# Altium schematic sheet Sheet1.SchDoc
size A2
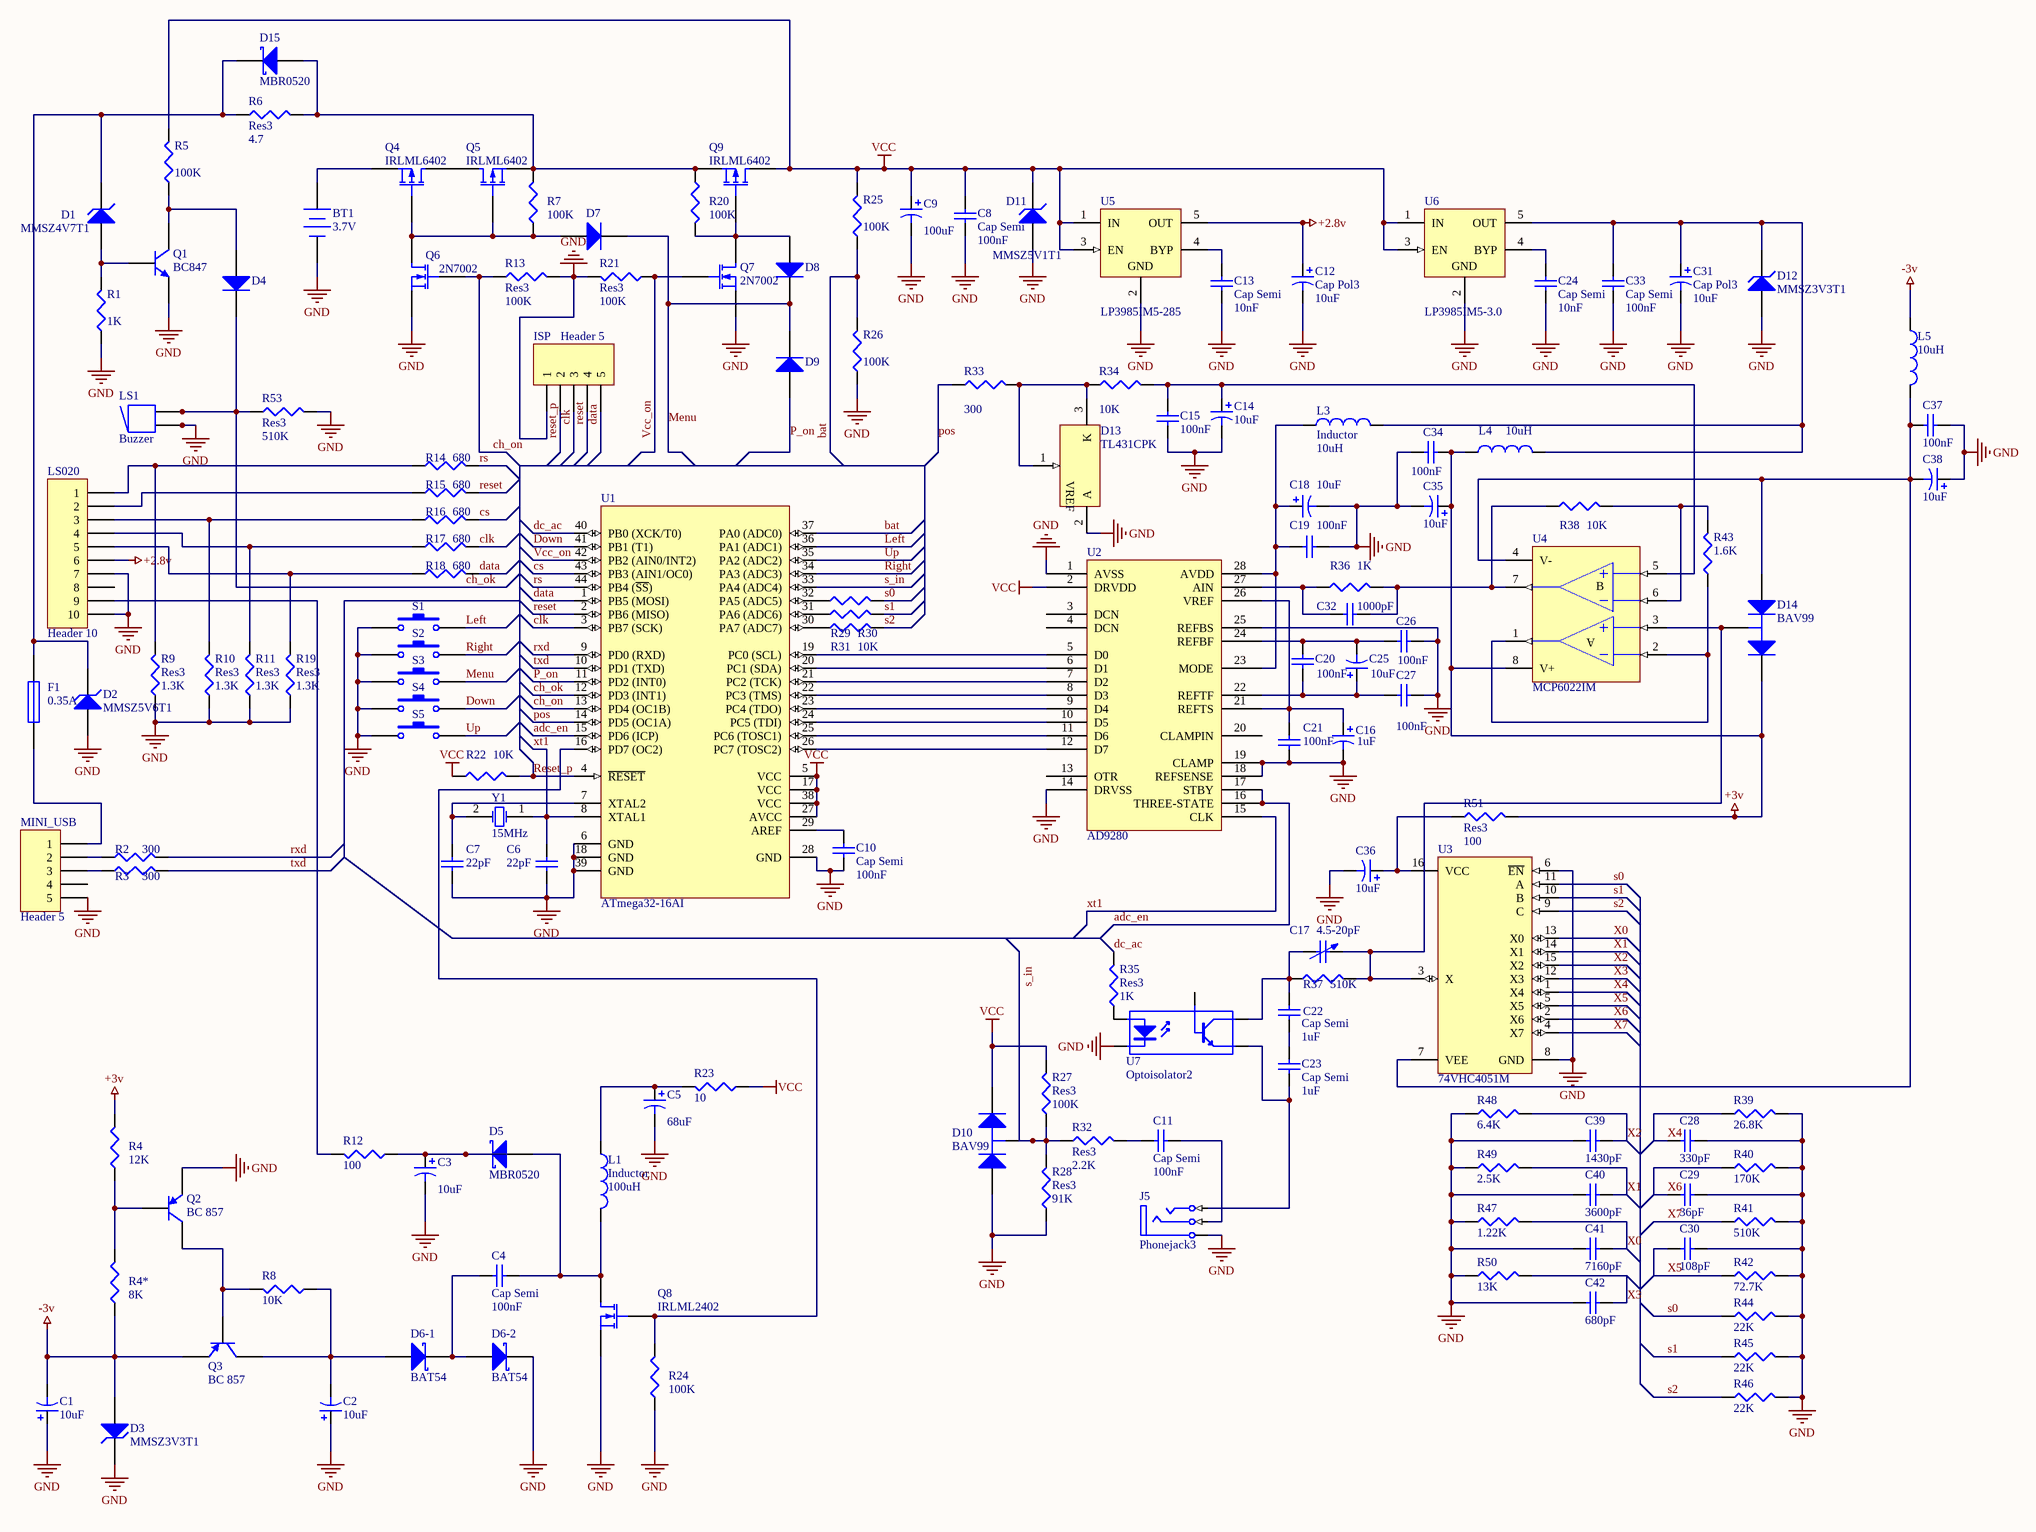
[diagram p0: Sheet1.SchDoc]

## Parts
BT1  3.7V  [BAT-2]
C1  value 10uF  [2220]  (hidden comment: Cap Pol3)
C2  value 10uF  [2220]  (hidden comment: Cap Pol3)
C3  value 10uF  [2220]  (hidden comment: Cap Pol3)
C4  Cap Semi  value 100nF  [C1206]
C5  value 68uF  [2220]  (hidden comment: Cap Pol3)
C6  value 22pF  [C1206]  (hidden comment: Cap Semi)
C7  value 22pF  [C1206]  (hidden comment: Cap Semi)
C8  Cap Semi  value 100nF  [C1206]
C9  value 100uF  [2220]  (hidden comment: Cap Pol3)
C10  Cap Semi  value 100nF  [C1206]
C11  Cap Semi  value 100nF  [C1206]
C12  Cap Pol3  value 10uF  [2220]
C13  Cap Semi  value 10nF  [C1206]
C14  value 10uF  [2220]  (hidden comment: Cap Pol3)
C15  value 100nF  [C1206]  (hidden comment: Cap Semi)
C16  value 1uF  [2220]  (hidden comment: Cap Pol3)
C17  4.5-20pF  [C1210]
C18  value 10uF  [2220]  (hidden comment: Cap Pol3)
C19  value 100nF  [C1206]  (hidden comment: Cap Semi)
C20  value 100nF  [C1206]  (hidden comment: Cap Semi)
C21  value 100nF  [C1206]  (hidden comment: Cap Semi)
C22  Cap Semi  value 1uF  [C1206]
C23  Cap Semi  value 1uF  [C1206]
C24  Cap Semi  value 10nF  [C1206]
C25  value 10uF  [2220]  (hidden comment: Cap Pol3)
C26  value 100nF  [C1206]  (hidden comment: Cap Semi)
C27  value 100nF  [C1206]  (hidden comment: Cap Semi)
C28  value 330pF  [C1206]  (hidden comment: Cap Semi)
C29  value 36pF  [C1206]  (hidden comment: Cap Semi)
C30  value 108pF  [C1206]  (hidden comment: Cap Semi)
C31  Cap Pol3  value 10uF  [2220]
C32  value 1000pF  [C1206]  (hidden comment: Cap Semi)
C33  Cap Semi  value 100nF  [C1206]
C34  value 100nF  [C1206]  (hidden comment: Cap Semi)
C35  value 10uF  [2220]  (hidden comment: Cap Pol3)
C36  value 10uF  [2220]  (hidden comment: Cap Pol3)
C37  value 100nF  [C1206]  (hidden comment: Cap Semi)
C38  value 10uF  [2220]  (hidden comment: Cap Pol3)
C39  value 1430pF  [C1206]  (hidden comment: Cap Semi)
C40  value 3600pF  [C1206]  (hidden comment: Cap Semi)
C41  value 7160pF  [C1206]  (hidden comment: Cap Semi)
C42  value 680pF  [C1206]  (hidden comment: Cap Semi)
D1  MMSZ4V7T1  [425]
D2  MMSZ5V6T1  [425]
D3  MMSZ3V3T1  [425]
D4  Diode  [SMC]  (value not drawn)
D5  MBR0520  [SMB]
D6-1  BAT54  [SOT23_L]
D6-2  BAT54  [SOT23_L]
D7  Diode  [SMC]  (value not drawn)
D8  Diode  [SMC]  (value not drawn)
D9  Diode  [SMC]  (value not drawn)
D10  BAV99  [SOT-23]
D11  MMSZ5V1T1  [425]
D12  MMSZ3V3T1  [425]
D13  TL431CPK  [PK03]
D14  BAV99  [SOT-23]
D15  MBR0520  [SMB]
F1  Current: 0.35A  [PIN-W2/E2.8]  (hidden comment: Fuse 1)
ISP  Header 5  [HDR1X5]
J5  Phonejack3  [JACK/6-V3]
L1  Inductor  V1: 100uH  [3261]
L3  Inductor  value 10uH  [3261]
L4  value 10uH  [3261]  (hidden comment: Inductor)
L5  value 10uH  [3261]  (hidden comment: Inductor)
LS1  Buzzer  [ABSM-1574]
LS020  Header 10  [HDR1X10]
MINI_USB  Header 5  [HDR1X5]
Q1  BC847  [SOT23_L]
Q2  BC 857  [SOT-23B]
Q3  BC 857  [SOT-23B]
Q4  IRLML6402  [SOT23]
Q5  IRLML6402  [SOT23]
Q6  2N7002  [SOT23]
Q7  2N7002  [SOT23]
Q8  IRLML2402  [SOT23]
Q9  IRLML6402  [SOT23]
R1  value 1K  [3225[1210]]  (hidden comment: Res3)
R2  value 300  [3225[1210]]  (hidden comment: Res3)
R3  value 300  [3225[1210]]  (hidden comment: Res3)
R4  value 12K  [3225[1210]]  (hidden comment: Res3)
R4*  value 8K  [3225[1210]]  (hidden comment: Res3)
R5  value 100K  [3225[1210]]  (hidden comment: Res3)
R6  Res3  value 4.7  [6332[2512]]
R7  value 100K  [3225[1210]]  (hidden comment: Res3)
R8  value 10K  [3225[1210]]  (hidden comment: Res3)
R9  Res3  value 1.3K  [3225[1210]]
R10  Res3  value 1.3K  [3225[1210]]
R11  Res3  value 1.3K  [3225[1210]]
R12  value 100  [3225[1210]]  (hidden comment: Res3)
R13  Res3  value 100K  [3225[1210]]
R14  value 680  [3225[1210]]  (hidden comment: Res3)
R15  value 680  [3225[1210]]  (hidden comment: Res3)
R16  value 680  [3225[1210]]  (hidden comment: Res3)
R17  value 680  [3225[1210]]  (hidden comment: Res3)
R18  value 680  [3225[1210]]  (hidden comment: Res3)
R19  Res3  value 1.3K  [3225[1210]]
R20  value 100K  [3225[1210]]  (hidden comment: Res3)
R21  Res3  value 100K  [3225[1210]]
R22  value 10K  [3225[1210]]  (hidden comment: Res3)
R23  value 10  [3225[1210]]  (hidden comment: Res3)
R24  value 100K  [3225[1210]]  (hidden comment: Res3)
R25  value 100K  [3225[1210]]  (hidden comment: Res3)
R26  value 100K  [3225[1210]]  (hidden comment: Res3)
R27  Res3  value 100K  [3225[1210]]
R28  Res3  value 91K  [3225[1210]]
R29  Res3  [3225[1210]]  (value not drawn)
R30  Res3  [3225[1210]]  (value not drawn)
R31  value 10K  [3225[1210]]  (hidden comment: Res3)
R32  Res3  value 2.2K  [3225[1210]]
R33  value 300  [3225[1210]]  (hidden comment: Res3)
R34  value 10K  [3225[1210]]  (hidden comment: Res3)
R35  Res3  value 1K  [3225[1210]]
R36  value 1K  [3225[1210]]  (hidden comment: Res3)
R37  value 510K  [3225[1210]]  (hidden comment: Res3)
R38  value 10K  [3225[1210]]  (hidden comment: Res3)
R39  value 26.8K  [3225[1210]]  (hidden comment: Res3)
R40  value 170K  [3225[1210]]  (hidden comment: Res3)
R41  value 510K  [3225[1210]]  (hidden comment: Res3)
R42  value 72.7K  [3225[1210]]  (hidden comment: Res3)
R43  value 1.6K  [3225[1210]]  (hidden comment: Res3)
R44  value 22K  [3225[1210]]  (hidden comment: Res3)
R45  value 22K  [3225[1210]]  (hidden comment: Res3)
R46  value 22K  [3225[1210]]  (hidden comment: Res3)
R47  value 1.22K  [3225[1210]]  (hidden comment: Res3)
R48  value 6.4K  [3225[1210]]  (hidden comment: Res3)
R49  value 2.5K  [3225[1210]]  (hidden comment: Res3)
R50  value 13K  [3225[1210]]  (hidden comment: Res3)
R51  Res3  value 100  [3225[1210]]
R53  Res3  value 510K  [3225[1210]]
S1  SW-PB  [SPST-2]  (value not drawn)
S2  SW-PB  [SPST-2]  (value not drawn)
S3  SW-PB  [SPST-2]  (value not drawn)
S4  SW-PB  [SPST-2]  (value not drawn)
S5  SW-PB  [SPST-2]  (value not drawn)
U1  ATmega32-16AI  [44A_N]
U2  AD9280  [SSOP28]
U3  74VHC4051M  [M16A_N]
U4  MCP6022IM  [M08A_L]
U5  LP3985IM5-285  [MF05A_L]
U6  LP3985IM5-3.0  [MF05A_L]
U7  Optoisolator2  [SOP5(6)]
Y1  15MHz  [R38]

## Nets
+2.8v: C12.1 LS020.6 U5.5(OUT)
+3v: C34.1 C35.1 D14.2(K) L4.1 R4.2 R51.2 U4.8(V+)
-3v: C1.2 D3.2(A) L5.1 Q3.3(E) R4*.1
GND: BT1.2(-) C1.1 C2.1 C3.2 C5.2 C6.1 C7.1 C8.1 C9.2 C10.1 C12.2 C13.1 C14.2 C15.2 C16.2 C18.2 C19.2 C21.1 C24.1 C26.1 C27.1 C28.1 C29.1 C30.1 C31.2 C33.1 C34.2 C35.2 C36.2 C37.1 C38.1 C39.2 C40.2 C41.2 C42.2 D2.2(A) D3.1(K) D6-2.3(K) D10.1(A) D11.2(A) D12.2(A) D13.2(A) ISP.1 J5.5(S) LS1.1 LS1.1A LS020.7 LS020.10 MINI_USB.5 Q1.2(E) Q2.3(E) Q6.3(S) Q7.3(S) Q8.3(S) R1.1 R9.1 R10.1 R11.1 R13.2 R19.1 R21.2 R24.1 R26.1 R28.1 R39.1 R40.1 R41.1 R42.1 R44.1 R45.1 R46.1 R47.2 R48.2 R49.2 R50.2 R53.2 S1.1 S2.1 S3.1 S4.1 S5.1 U1.6(GND) U1.18(GND) U1.28(GND) U1.39(GND) U2.1(AVSS) U2.14(DRVSS) U2.18(REFSENSE) U2.19(CLAMP) U2.25(REFBS) U3.6(~{EN}) U3.8(GND) U5.2(GND) U6.2(GND) U7.3(K)
VCC: C8.2 C9.1 D10.2(K) D11.1(K) Q9.1(D) R5.2 R22.1 R23.1 R25.2 R27.2 U1.5(VCC) U1.17(VCC) U1.27(AVCC) U1.38(VCC) U2.2(DRVDD) U5.1(IN) U5.3(EN) U6.1(IN) U6.3(EN)
adc_en: U1.15(PD6_(ICP)) U2.16(THREE-STATE) U2.17(STBY)
bat: R25.1 R26.2 U1.37(PA0_(ADC0))
ch_ok: D4.2(K) LS1.2 LS1.2A R53.1 U1.12(PD3_(INT1))
ch_on: Q6.2(G) R13.1 U1.13(PD4_(OC1B))
clk: ISP.3 R17.2 U1.3(PB7_(SCK))
cs: R16.2 U1.43(PB3_(AIN1/OC0))
data: ISP.5 R18.2 U1.1(PB5_(MOSI))
dc_ac: R35.2 U1.40(PB0_(XCK/T0))
Down: S4.2 U1.41(PB1_(T1))
Left: S1.2 U1.36(PA1_(ADC1))
Menu: D7.2(K) D8.2(K) D9.2(K) S3.2
P_on: D9.1(A) U1.11(PD2_(INT0))
pos: R33.1 U1.14(PD5_(OC1A))
reset: ISP.4 R15.2 U1.2(PB6_(MISO))
Reset_p: ISP.2 R22.2 U1.4(~{RESET})
Right: S2.2 U1.34(PA3_(ADC3))
rs: R14.2 U1.44(PB4_(~{SS}))
rxd: R3.2 U1.9(PD0_(RXD))
s0: R29.2 R44.2 U3.11(A)
s1: R30.2 R45.2 U3.10(B)
s2: R31.2 R46.2 U3.9(C)
s_in: D10.3(C) R27.1 R28.2 R32.1 U1.33(PA4_(ADC4))
txd: R2.2 U1.10(PD1_(TXD))
Up: S5.2 U1.35(PA2_(ADC2))
Vcc_on: Q7.2(G) R21.1 U1.42(PB2_(AIN0/INT2))
X0: C41.1 R47.1 U3.13(X0)
X1: C40.1 R49.1 U3.14(X1)
X2: C39.1 R48.1 U3.15(X2)
X3: C42.1 R50.1 U3.12(X3)
X4: C28.2 R39.2 U3.1(X4)
X5: C30.2 R42.2 U3.5(X5)
X6: C29.2 R40.2 U3.2(X6)
X7: R41.2 U3.4(X7)
xt1: C6.2 U1.8(XTAL1) U2.15(CLK) Y1.1(OSC1)
NetBT1_1: BT1.1(+) Q4.3(S)
NetC2_2: C2.2 D6-1.1(A) Q3.1(C) R8.1
NetC3_1: C3.1 D5.2(K) R12.1
NetC4_1: C4.1 D5.1(A) L1.2 Q8.1(D)
NetC4_2: C4.2 D6-1.3(K) D6-2.1(A)
NetC5_1: C5.1 L1.1 R23.2
NetC7_2: C7.2 U1.7(XTAL2) Y1.2(OSC2)
NetC10_2: C10.2 U1.29(AREF)
NetC11_1: C11.1 R32.2
NetC11_2: C11.2 J5.3(R)
NetC13_2: C13.2 U5.4(BYP)
NetC14_1: C14.1 C15.1 R34.2 U4.5(INB+)
NetC16_1: C16.1 C21.2 U2.21(REFTS) U2.26(VREF)
NetC17_1: C17.1 C22.2 R37.1 U7.5(C)
NetC17_2: C17.2 D14.3(C) R37.2 U3.3(X) U4.3(INA+)
NetC18_1: C18.1 C19.1 L3.1 U2.23(MODE) U2.28(AVDD)
NetC20_1: C20.1 C25.1 C27.2 U2.22(REFTF)
NetC20_2: C20.2 C25.2 C26.2 U2.24(REFBF)
NetC22_1: C22.1 C23.2
NetC23_1: C23.1 J5.1(T) U7.4(E)
NetC24_2: C24.2 U6.4(BYP)
NetC31_1: C31.1 C33.2 D12.1(K) L3.2 L4.2 U6.5(OUT)
NetC32_1: C32.1 R36.1 U2.27(AIN)
NetC32_2: C32.2 R36.2 R38.1 U4.7(OUTB)
NetC36_1: C36.1 R51.1 U3.16(VCC)
NetC37_2: C37.2 C38.2 D14.1(A) L5.2 U3.7(VEE) U4.4(V-)
NetD1_1: D1.1(K) D2.1(K) D15.2(K) F1.2 R6.1
NetD1_2: D1.2(A) Q1.1(B) R1.2
NetD4_1: D4.1(A) Q1.3(C) R5.1
NetD7_1: D7.1(A) Q4.2(G) Q5.2(G) Q6.1(D) R7.1
NetD8_1: D8.1(A) Q7.1(D) Q9.2(G) R20.2
NetD13_1: D13.1(VREF) D13.3(K) R33.2 R34.1
NetD15_1: D15.1(A) Q5.3(S) Q9.3(S) R6.2 R7.2 R20.1
NetF1_1: F1.1 MINI_USB.1
NetLS020_1: LS020.1 R9.2 R14.1
NetLS020_2: LS020.2 R15.1
NetLS020_3: LS020.3 R10.2 R16.1
NetLS020_4: LS020.4 R11.2 R17.1
NetLS020_5: LS020.5 R18.1 R19.2
NetLS020_9: LS020.9 R12.2
NetMINI_USB_2: MINI_USB.2 R3.1
NetMINI_USB_3: MINI_USB.3 R2.1
NetQ2_1: Q2.1(C) Q3.2(B) R8.2
NetQ2_2: Q2.2(B) R4.1 R4*.2
NetQ4_1: Q4.1(D) Q5.1(D)
NetQ8_2: Q8.2(G) R24.2 U1.16(PD7_(OC2))
NetR29_1: R29.1 U1.32(PA5_(ADC5))
NetR30_1: R30.1 U1.31(PA6_(ADC6))
NetR31_1: R31.1 U1.30(PA7_(ADC7))
NetR35_1: R35.1 U7.1(A)
NetR38_2: R38.2 R43.2 U4.6(INB-)
NetR43_1: R43.1 U4.1(OUTA) U4.2(INA-)
NetU1_19: U1.19(PC0_(SCL)) U2.5(D0)
NetU1_20: U1.20(PC1_(SDA)) U2.6(D1)
NetU1_21: U1.21(PC2_(TCK)) U2.7(D2)
NetU1_22: U1.22(PC3_(TMS)) U2.8(D3)
NetU1_23: U1.23(PC4_(TDO)) U2.9(D4)
NetU1_24: U1.24(PC5_(TDI)) U2.10(D5)
NetU1_25: U1.25(PC6_(TOSC1)) U2.11(D6)
NetU1_26: U1.26(PC7_(TOSC2)) U2.12(D7)

Not connected (* = marked no-connect by the designer): LS020 8; MINI_USB 4; U2 3(DCN) 4(DCN) 13(OTR) 20(CLAMPIN); U7 6(B)

## Notes on the sheet
- (in symbol LMC6022IM) B; A

## Library data of the parts
BT1 = Battery: Multicell Battery; Published: 24-Mar-1999; LatestRevisionDate: 17-Jul-2002; LatestRevisionNote: Re-released for DXP Platform.; PackageReference: BAT-2; Publisher: Altium Limited
C1-C3 C5 C9 C12 C14 C16 C18 C25 C31 C35 C36 C38 = Cap Pol3: Polarized Capacitor (Surface Mount); Published: 8-Jun-2000; LatestRevisionDate: 17-Jul-2002; LatestRevisionNote: Re-released for DXP Platform.; PackageReference: C0805; Publisher: Altium Limited
C4 C6-C8 C10 C11 C13 C15 C19-C24 C26-C30 C32-C34 C37 C39-C42 = Cap Semi: Capacitor (Semiconductor SIM Model); Published: 8-Jun-2000; LatestRevisionDate: 17-Jul-2002; LatestRevisionNote: Re-released for DXP Platform.; PackageReference: C1206; Publisher: Altium Limited
C17 = Cap Var: Variable or Adjustable Capacitor; Value: 100pF; Published: 24-Mar-1999; LatestRevisionDate: 17-Jul-2002; LatestRevisionNote: Re-released for DXP Platform.; PackageReference: C1210; Publisher: Altium Limited
D1 = MMSZ4V7T1: Surface Mount Silicon Zener Diode; Published: 29-Sep-2000; LatestRevisionDate: 19-Mar-2004; LatestRevisionNote: Silkscreen size reduced; PCB footprint pad transposed.; PackageVersion: 1988; PackageReference: 425; Publisher: Altium Limited; PackageDescription: SOD-123; 2 Leads; Body 2.7 x 1.6 mm, (LxW); ComponentLink1Description: Manufacturer Link; ComponentLink1URL: http://www.onsemi.com/site/products/landing?taxonomyID=194; ComponentLink2Description: Datasheet; ComponentLink2URL: http://www.onsemi.com/pub/Collateral/MMSZ2V4T1-D.PDF
D2 = MMSZ5V6T1: Surface Mount Silicon Zener Diode; Published: 29-Sep-2000; LatestRevisionDate: 19-Mar-2004; LatestRevisionNote: Silkscreen size reduced; PCB footprint pad transposed.; PackageVersion: 1988; PackageReference: 425; Publisher: Altium Limited; PackageDescription: SOD-123; 2 Leads; Body 2.7 x 1.6 mm, (LxW); ComponentLink1Description: Manufacturer Link; ComponentLink1URL: http://www.onsemi.com/site/products/landing?taxonomyID=194; ComponentLink2Description: Datasheet; ComponentLink2URL: http://www.onsemi.com/pub/Collateral/MMSZ2V4T1-D.PDF
D3 D12 = MMSZ3V3T1: Surface Mount Silicon Zener Diode; Published: 29-Sep-2000; LatestRevisionDate: 19-Mar-2004; LatestRevisionNote: Silkscreen size reduced; PCB footprint pad transposed.; PackageVersion: 1988; PackageReference: 425; Publisher: Altium Limited; PackageDescription: SOD-123; 2 Leads; Body 2.7 x 1.6 mm, (LxW); ComponentLink1Description: Manufacturer Link; ComponentLink1URL: http://www.onsemi.com/site/products/landing?taxonomyID=194; ComponentLink2Description: Datasheet; ComponentLink2URL: http://www.onsemi.com/pub/Collateral/MMSZ2V4T1-D.PDF
D4 D7-D9 = Diode: Default Diode; Published: 8-Jun-2000; LatestRevisionDate: 17-Jul-2002; LatestRevisionNote: Re-released for DXP Platform.; PackageDocument: Sep-1996; PackageReference: SMC; Publisher: Altium Limited; Code_JEDEC: DO-214-AB
D5 D15 = D Schottky: Schottky Diode; Published: 8-Jun-2000; LatestRevisionDate: 17-Jul-2002; LatestRevisionNote: Re-released for DXP Platform.; PackageReference: SMB; Publisher: Altium Limited; Code_JEDEC: DO-214-AA
D6-1 D6-2 = BAT54: Schottky Barrier Diode; Note: Pin 2 is not connected and is not drawn; Published: 17-Sep-2003; LatestRevisionDate: 12-Dec-2006; LatestRevisionNote: IPC-7351 Footprint Added.; DatasheetVersion: 4-Mar-2002; PackageVersion: May-1999; PackageReference: SOT23; Publisher: Altium Limited; PackageDescription: 3-Pin SOT-23 Package 0.95 mm Pitch, 2.3 mm Lead Span; ComponentLink1Description: Manufacturer Link; ComponentLink1URL: http://www.semiconductors.philips.com/; ComponentLink2Description: Datasheet; ComponentLink2URL: http://www.semiconductors.philips.com/acrobat/datasheets/BAT54_SERIES_4.pdf
D10 D14 = BAV99: Silicon Switching Diode Array for High-Speed Switching; Published: 21-Mar-2003; DatasheetDocument: Oct-1999; PackageDocument: Sep-2001; PackageReference: SOT-23; Publisher: Altium Limited; ComponentLink1Description: Manufacturer Link; ComponentLink1URL: http://www.infineon.com/; ComponentLink2Description: Datasheet; ComponentLink2URL: http://www.infineon.com/upload/Document/cmc_upload/documents/080/631/bav99series_1.pdf
D11 = MMSZ5V1T1: Surface Mount Silicon Zener Diode; Published: 29-Sep-2000; LatestRevisionDate: 19-Mar-2004; LatestRevisionNote: Silkscreen size reduced; PCB footprint pad transposed.; PackageVersion: 1988; PackageReference: 425; Publisher: Altium Limited; PackageDescription: SOD-123; 2 Leads; Body 2.7 x 1.6 mm, (LxW); ComponentLink1Description: Manufacturer Link; ComponentLink1URL: http://www.onsemi.com/site/products/landing?taxonomyID=194; ComponentLink2Description: Datasheet; ComponentLink2URL: http://www.onsemi.com/pub/Collateral/MMSZ2V4T1-D.PDF
D13 = TL431CPK: Adjustable Precision Shunt Regulator; Published: 15-Apr-2002; DatasheetVersion: Oct-2000; PackageVersion: Oct-1994; PackageReference: PK03; Publisher: Altium Limited; PackageDescription: SOT-89; Body 4.6 x 4.25 mm, inc. leads (LxW max); Code_JEDEC: TO-243-AA; Code_IPC: SOT 89; ComponentLink1Description: Manufacturer Link; ComponentLink1URL: http://www.ti.com/; ComponentLink2Description: Datasheet; ComponentLink2URL: http://www-s.ti.com/sc/ds/tl431a.pdf
F1 = Fuse 1: Fuse; Published: 8-Jun-2000; LatestRevisionDate: 17-Jul-2002; LatestRevisionNote: Re-released for DXP Platform.; PackageReference: PIN-W2/E2.8; Publisher: Altium Limited
ISP MINI_USB = Header 5: Header, 5-Pin; LatestRevisionDate: 17-Jul-2002; LatestRevisionNote: Re-released for DXP Platform.; Publisher: Altium Limited
J5 = Phonejack3: Jack Socket, 1/4" [6.5mm], Thru-Hole, Vertical, 3-Conductor Open Circuit (Non-Normalling); PackageDocument: 2003; PCB_Layout: Complies with manufacturer's recommendation.; DrillAndSlotSize: Corresponds to nominal value.; Published: 15-Jul-2004; LatestRevisionDate: 15-Jul-2004; LatestRevisionNote: Component Replaced.; DatasheetDocument: 2003; PackageReference: S1VS_SSS; Publisher: Altium Limited; ComponentLink1Description: Manufacturer Link; ComponentLink1URL: http://www.cliffuk.co.uk/
L1 L3-L5 = Inductor: Code_IEC: 1005; Published: 8-Jun-2000; LatestRevisionDate: 17-Jul-2002; LatestRevisionNote: Re-released for DXP Platform.; PackageReference: 0402-A; Publisher: Altium Limited; Code_JEITA: 0402
LS1 = Buzzer: Magnetic Transducer Buzzer; Published: 24-Mar-1999; LatestRevisionDate: 17-Dec-2003; LatestRevisionNote: Schematic revised, PCB Footprint replaced.; DatasheetDocument: 17-Dec-2003; PackageReference: ABSM-1574; Publisher: Altium Limited; ComponentLink1Description: Manufacturer Link; ComponentLink1URL: http://www.megastar.com/linecard/buzzmode/index.php
LS020 = Header 10: Header, 10-Pin; LatestRevisionDate: 17-Jul-2002; LatestRevisionNote: Re-released for DXP Platform.; Publisher: Altium Limited
Q1 = BC847: NPN General-purpose Transistor; Published: 17-Sep-2003; LatestRevisionDate: 12-Dec-2006; LatestRevisionNote: IPC-7351 Footprint Added.; DatasheetVersion: 4-Feb-2002; PackageVersion: May-1999; PackageReference: SOT23; Publisher: Altium Limited; PackageDescription: 3-Pin SOT-23 Package 0.95 mm Pitch, 2.3 mm Lead Span; ComponentLink1Description: Manufacturer Link; ComponentLink1URL: http://www.semiconductors.philips.com/; ComponentLink2Description: Datasheet; ComponentLink2URL: http://www.semiconductors.philips.com/acrobat/datasheets/BC846_BC847_BC848_5.pdf
Q2 Q3 = PNP: PNP Bipolar Transistor; Published: 8-Jun-2000; LatestRevisionDate: 17-Jul-2002; LatestRevisionNote: Re-released for DXP Platform.; PackageReference: SOT-23B; Publisher: Altium Limited; Code_JEDEC: SOT-23
Q4 Q5 Q9 = MOSFET-P: P-Channel MOSFET; pin to pad: 1>3 2>1 3>2; PackageDocument: 1995/1996; Published: 8-Jun-2000; LatestRevisionDate: 17-Jul-2002; LatestRevisionNote: Re-released for DXP Platform.; PackageReference: E3; Publisher: Altium Limited
Q6-Q8 = MOSFET-N: N-Channel MOSFET; pin to pad: 1>3 2>1 3>2; PackageDocument: 1995/1996; Published: 8-Jun-2000; LatestRevisionDate: 17-Jul-2002; LatestRevisionNote: Re-released for DXP Platform.; PackageReference: E3; Publisher: Altium Limited
R1-R4 R4* R5-R28 R31-R51 R53 = Res3: Resistor; Published: 8-Jun-2000; LatestRevisionDate: 04-Mar-2005; LatestRevisionNote: PCB Footprint replaced.; PackageReference: J1-0603; Publisher: Altium Limited
R29 R30 = Res3: Resistor; Value: 10K; Published: 8-Jun-2000; LatestRevisionDate: 04-Mar-2005; LatestRevisionNote: PCB Footprint replaced.; PackageReference: J1-0603; Publisher: Altium Limited
S1-S5 = SW-PB: Switch; Published: 24-Mar-1999; LatestRevisionDate: 17-Jul-2002; LatestRevisionNote: Re-released for DXP Platform.; PackageReference: SPST-2; Publisher: Altium Limited
U1 = ATmega32-16AI: 8-Bit AVR Microcontroller with 32K Bytes of In-System Programmable Flash Memory; Published: 17-Sep-2003; LatestRevisionDate: 13-Apr-2006; LatestRevisionNote: IPC-7351 Footprint Added.; DatasheetVersion: 2503C-AVR-10/02; PackageVersion: rev.B, Oct-2001; PackageReference: 44A; Publisher: Altium Limited; PackageDescription: 44-Pin Thin Quad Flat Pack 0.8 mm Pitch; ComponentLink1Description: Manufacturer Link; ComponentLink1URL: http://www.atmel.com; ComponentLink2Description: Datasheet; ComponentLink2URL: http://www.atmel.com/dyn/resources/prod_documents/doc2503.pdf
U3 = 74VHC4051M: 8-Channel Analog Multiplexer; Published: 17-Jul-2002; LatestRevisionDate: 13-Apr-2006; LatestRevisionNote: IPC-7351 Footprint Added.; DatasheetVersion: Apr-1999; PackageVersion: 2000; PackageReference: M16A; Publisher: Altium Limited; PackageDescription: 16-Pin Small Outline Integrated Circuit 1.27 mm Pitch; Code_IPC: SOIC127P600-16; ComponentLink1Description: Manufacturer Link; ComponentLink1URL: http://www.fairchildsemi.com/; ComponentLink2Description: Datasheet; ComponentLink2URL: http://www.fairchildsemi.com/ds/74%2F74VHC4051.pdf
U4 = LMC6022IM: Low Power CMOS Dual Operational Amplifier; Manufacturer: National Semiconductor; CompType: Amplifiers; PackageTopMarking: NSZXTT*LMC60*22IM; Published: 27-Nov-2008; DatasheetVersion: Oct-2004; PackageVersion: revL, Sep-2006; PackageReference: M08A; Publisher: Altium Limited; PackageDescription: SOIC Narrow, 4.9 x 3.9 x 1.45mm, 8 Lead, 1.27mm Pitch; PartNumber: LMC6022IM; RoHS: O; PinCount: 8; DigiKeyPartNumber: LMC6022IM-ND; Code_JEDEC: MS-012-AA; Code_IPC: SOIC127P600-8; ComponentLink1Description: LMC6022 Datasheet; ComponentLink1URL: http://www.national.com/ds/LM/LMC6022.pdf; ComponentLink2Description: LMC6022 Web Page; ComponentLink2URL: http://www.national.com/pf/LM/LMC6022.html; ComponentLink3Description: M08A Package Page; ComponentLink3URL: http://www.national.com/packaging/folders/m08a.html
U5 = LP3985IM5-285: Micropower, 150mA Low-Noise Ultra Low-Dropout CMOS Voltage Regulator; Manufacturer: National Semiconductor; CompType: LDO IC; PackageTopMarking: LCXB*XTT; Published: 27-Nov-2008; DatasheetVersion: Aug-2005; PackageVersion: revD, Aug-2008; PackageReference: MF05A; Publisher: Altium Limited; PackageDescription: Molded SOT-23, .115 x .063 x .040 in Body, 5 Lead, .0375 in Pitch; PartNumber: LP3985IM5-285; RoHS: Y; PinCount: 5; DigiKeyPartNumber: LP3985IM5-285CT-ND; Code_IPC: SOT23-5; ComponentLink1Description: LP3985 Datasheet; ComponentLink1URL: http://www.national.com/ds/LP/LP3985.pdf; ComponentLink2Description: LP3985 Web Page; ComponentLink2URL: http://www.national.com/pf/LP/LP3985.html; ComponentLink3Description: MF05A Package Page; ComponentLink3URL: http://www.national.com/packaging/folders/mf05a.html
U6 = LP3985IM5-3.0: Micropower, 150mA Low-Noise Ultra Low-Dropout CMOS Voltage Regulator; Manufacturer: National Semiconductor; CompType: LDO IC; PackageTopMarking: LCRB*XTT; Published: 27-Nov-2008; DatasheetVersion: Aug-2005; PackageVersion: revD, Aug-2008; PackageReference: MF05A; Publisher: Altium Limited; PackageDescription: Molded SOT-23, .115 x .063 x .040 in Body, 5 Lead, .0375 in Pitch; PartNumber: LP3985IM5-3.0; RoHS: O; PinCount: 5; DigiKeyPartNumber: LP3985IM5-3.0CT-ND; Code_IPC: SOT23-5; ComponentLink1Description: LP3985 Datasheet; ComponentLink1URL: http://www.national.com/ds/LP/LP3985.pdf; ComponentLink2Description: LP3985 Web Page; ComponentLink2URL: http://www.national.com/pf/LP/LP3985.html; ComponentLink3Description: MF05A Package Page; ComponentLink3URL: http://www.national.com/packaging/folders/mf05a.html
U7 = Optoisolator2: 5 Pin Mini Flat Pack Optocoupler; pin to pad: 5>6 6>5; Published: 24-Mar-1999; LatestRevisionDate: 04-Mar-2005; LatestRevisionNote: PCB Footprint replaced, Sch pins re-numbered.; DatasheetDocument: Apr-2004; PackageReference: SOP5(6); Publisher: Altium Limited
Y1 = XTAL: Crystal Oscillator; Published: 8-Jun-2000; LatestRevisionDate: 17-Jul-2002; LatestRevisionNote: Re-released for DXP Platform.; PackageReference: R38; Publisher: Altium Limited